# Altium schematic sheet F411CEU6.SchDoc
size A4; SheetNumber: 1; SheetTotal: 1
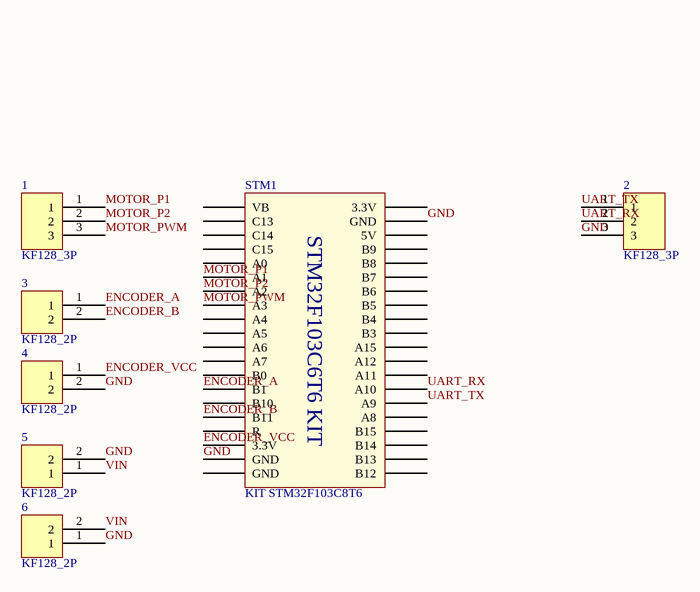
[diagram p0: F411CEU6.SchDoc]

## Parts
1  KF128_3P  [KF128_3P]
2  KF128_3P  [KF128_3P]
3  KF128_2P  [KF128_2P]
4  KF128_2P  [KF128_2P]
5  KF128_2P  [KF128_2P]
6  KF128_2P  [KF128_2P]
STM1  KIT STM32F103C8T6  [STM32F103 KIT]

## Nets
ENCODER_A: 3.1 STM1.34(B1)
ENCODER_B: 3.2 STM1.36(B11)
ENCODER_VCC: 4.1 STM1.38(3.3V)
GND: 2.3 4.2 5.2 6.1 STM1.19(GND) STM1.39(GND)
MOTOR_P1: 1.1 STM1.26(A1)
MOTOR_P2: 1.2 STM1.27(A2)
MOTOR_PWM: 1.3 STM1.28(A3)
UART_RX: 2.2 STM1.7(A10)
UART_TX: 2.1 STM1.6(A9)
VIN: 5.1 6.2

Not connected (* = marked no-connect by the designer): STM1 1(B12) 2(B13) 3(B14) 4(B15) 5(A8) 8(A11) 9(A12) 10(A15) 11(B3) 12(B4) 13(B5) 14(B6) 15(B7) 16(B8) 17(B9) 18(5V) 20(3.3V) 21(VB) 22(C13) 23(C14) 24(C15) 25(A0) 29(A4) 30(A5) 31(A6) 32(A7) 33(B0) 35(B10) 37(R) 40(GND)

## Notes on the sheet
- Title
- Size:
- Date:
- A4
- Number:
- Time:
- Revision:
- Sheet
- of
- File:
- (in symbol STM32f103 Bluepill) STM32F103C6T6 KIT

## Library data of the parts
1 2 = KF128_3P: KF128 - pin spacing 3.81mm - 3P; Ma hang: Domino KF128-3.81 3Pin
3-6 = KF128_2P: KF128 - pin spacing 3.81mm - 2P; Ma hang: Domino KF128-3.81 2Pin
STM1 = STM32f103 Bluepill: KIT STM32F103C8T6 Bluepill